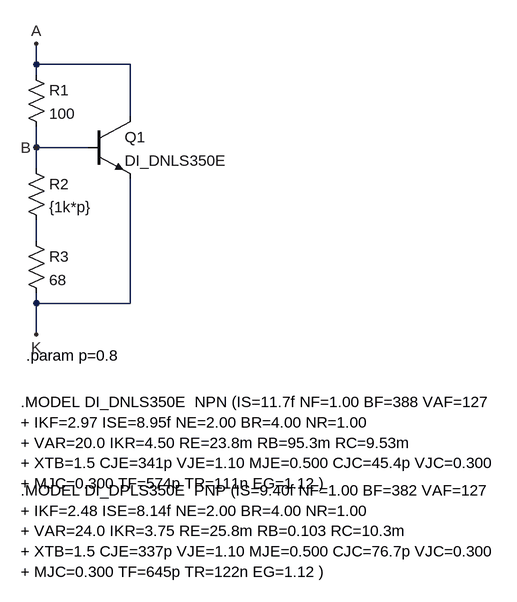
[diagram p0: schematic rubber_diode.asc]
rubber_diode.asc, the LTspice schematic file:
Version 4
SHEET 1 912 680
WIRE 160 -336 160 -368
WIRE 304 -336 160 -336
WIRE 160 -320 160 -336
WIRE 304 -256 304 -336
WIRE 160 -208 160 -240
WIRE 240 -208 160 -208
WIRE 160 -176 160 -208
WIRE 160 -64 160 -96
WIRE 160 32 160 16
WIRE 304 32 304 -160
WIRE 304 32 160 32
WIRE 160 80 160 32
FLAG 160 80 K
FLAG 160 -208 B
FLAG 160 -368 A
SYMBOL npn 240 -256 R0
SYMATTR InstName Q1
SYMATTR Value DI_DNLS350E
SYMBOL res 144 -336 R0
SYMATTR InstName R1
SYMATTR Value 100
SYMBOL res 144 -192 R0
SYMATTR InstName R2
SYMATTR Value {1k*p}
SYMBOL res 144 -80 R0
SYMATTR InstName R3
SYMATTR Value 68
TEXT 136 184 Left 2 !.MODEL DI_DNLS350E  NPN (IS=11.7f NF=1.00 BF=388 VAF=127\n+ IKF=2.97 ISE=8.95f NE=2.00 BR=4.00 NR=1.00\n+ VAR=20.0 IKR=4.50 RE=23.8m RB=95.3m RC=9.53m\n+ XTB=1.5 CJE=341p VJE=1.10 MJE=0.500 CJC=45.4p VJC=0.300\n+ MJC=0.300 TF=574p TR=111n EG=1.12 )
TEXT 136 320 Left 2 !.MODEL DI_DPLS350E  PNP (IS=9.40f NF=1.00 BF=382 VAF=127\n+ IKF=2.48 ISE=8.14f NE=2.00 BR=4.00 NR=1.00\n+ VAR=24.0 IKR=3.75 RE=25.8m RB=0.103 RC=10.3m\n+ XTB=1.5 CJE=337p VJE=1.10 MJE=0.500 CJC=76.7p VJC=0.300\n+ MJC=0.300 TF=645p TR=122n EG=1.12 )
TEXT 144 112 Left 2 !.param p=0.8

The netlist it stands for:
* rubber_diode.asc
Q1 A B K 0 DI_DNLS350E
R1 A B 100
R2 B N001 {1k*p}
R3 N001 K 68
.model NPN NPN
.model PNP PNP
.lib standard.bjt
.MODEL DI_DNLS350E  NPN (IS=11.7f NF=1.00 BF=388 VAF=127
+ IKF=2.97 ISE=8.95f NE=2.00 BR=4.00 NR=1.00
+ VAR=20.0 IKR=4.50 RE=23.8m RB=95.3m RC=9.53m
+ XTB=1.5 CJE=341p VJE=1.10 MJE=0.500 CJC=45.4p VJC=0.300
+ MJC=0.300 TF=574p TR=111n EG=1.12 )
.MODEL DI_DPLS350E  PNP (IS=9.40f NF=1.00 BF=382 VAF=127
+ IKF=2.48 ISE=8.14f NE=2.00 BR=4.00 NR=1.00
+ VAR=24.0 IKR=3.75 RE=25.8m RB=0.103 RC=10.3m
+ XTB=1.5 CJE=337p VJE=1.10 MJE=0.500 CJC=76.7p VJC=0.300
+ MJC=0.300 TF=645p TR=122n EG=1.12 )
.param p=0.8
.backanno
.end